# Altium schematic sheet midi_input.SchDoc
size A4; Organization: Altium Limited; Address1: L3, 12a Rodborough Rd; Address2: Frenchs Forest; Address3: NSW; Address4: Australia 2086
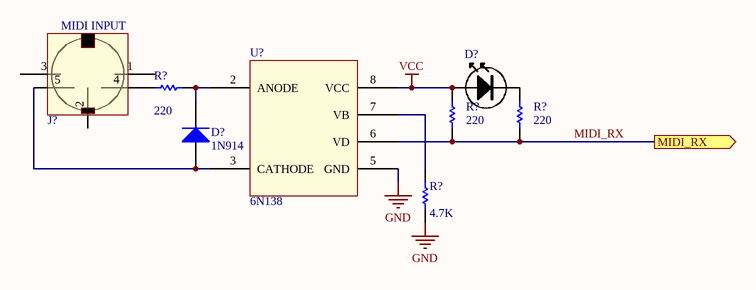
[diagram p0: midi_input.SchDoc]

## Parts
(Parts that share a designator on the sheet are numbered #1, #2 ... from top to bottom, then left to right.)
D?#1  LED-GREEN-5MM  [LED-5MM-GREEN]  (value not drawn)
D?#2  1N914  [DO-35]
J?  MIDI INPUT  [SDS-50J]
R?#1  value 220  [AXIAL-0.3]
R?#2  value 220  [AXIAL-0.3]
R?#3  value 220  [AXIAL-0.3]
R?#4  value 4.7K  [AXIAL-0.3]
U?  6N138  [DIP8]

## Ports
MIDI_RX (out)

## Nets
GND: R?#4.1 U?.5(GND)
VCC: D?#1.A R?#2.2 U?.8(VCC)
MIDI_RX: R?#2.1 R?#3.1 U?.6(VD) ; port MIDI_RX
NetD?#1_K: D?#1.K R?#3.2
NetD?#2_1: D?#2.1(A) J?.5 U?.3(CATHODE)
NetD?#2_2: D?#2.2(K) R?#1.1 U?.2(ANODE)
NetJ?_4: J?.4 R?#1.2
NetR?#4_2: R?#4.2 U?.7(VB)

Not connected (* = marked no-connect by the designer): J? 1 2 3

## Notes on the sheet
- Title
- Size:
- Date:
- A4
- Number:
- Time:
- Revision:
- Sheet
- of
- File:

## Library data of the parts
D?#1 = LED-GREEN-5MM: Manufacturer: Cree Inc; Manufacturer Part Number: C4SMF-GJS-CV0Y0792; Description: LED 4MM OVAL GREEN 527NM; Color: Green; Wavelength - Dominant: 527nm; Millicandela Rating: 5165mcd; Voltage - Forward (Vf) (Typ): 3.4V; Current - Test: 20mA; Lens Transparency: Clear; Lens Style/Size: Oval with Domed Top, 4.20mm x 3.10mm; Supplier 1: Digi-Key; RoHS: RoHS Compliant; Category: Optoelectronics; Stock 1: 5356; Pricing 1: 1=0.22, 10=0.205, 100=0.1892, 1000=0.169 (USD); Packaging: Cut Tape (CT); Wavelength - Peak: -; Viewing Angle: -; Lens Color: Green; Package / Case: Radial; Supplier Device Package: 4mm Oval; Size / Dimension: -; Height (Max): 10.35mm; Mounting Type: Through Hole; ComponentLink1URL: http://www.cree.com/~/media/Files/Cree/LED%20Components%20and%20Modules/HB/Data%20Sheets/C4SMF%20C4SME%20RJS%20GJS%20BJS%20829.pdf; ComponentLink1Description: http://www.cree.com/~/media/Files/Cree/LED%20Components%20and%20Modules/HB/Data%20Sheets/C4SMF%20C4SME%20RJS%20GJS%20BJS%20829.pdf
D?#2 = 1N914: High Conductance Fast Diode; Manufacturer: Fairchild Semiconductor; Manufacturer Part Number: 1N914BTR; Description: DIODE GEN PURP 100V 200MA DO35; Diode Type: Standard; Voltage - DC Reverse (Vr) (Max): 100V; Current - Average Rectified (Io): 200mA; Voltage - Forward (Vf) (Max) @ If: 1V @ 100mA; Speed: Small Signal =< 200mA (Io), Any Speed; Reverse Recovery Time (trr): 4ns; Current - Reverse Leakage @ Vr: 5µA @ 75V; Capacitance @ Vr, F: 4pF @ 0V, 1MHz; Published: 8-Jun-2000; LatestRevisionDate: 17-Jul-2002; LatestRevisionNote: Re-released for DXP Platform.; DatasheetDocument: 1997; PackageReference: DO-35; Publisher: Altium Limited; Code_JEDEC: DO-204-AH; ComponentLink1Description: Manufacturer Link; ComponentLink1URL: http://www.fairchildsemi.com/; ComponentLink2Description: Datasheet; ComponentLink2URL: http://www.fairchildsemi.com/ds/1N%2F1N914.pdf; Supplier 1: Digi-Key; RoHS: RoHS Compliant; Category: Discrete Semiconductor Products; Stock 1: 135448; Pricing 1: 1=0.1, 10=0.064, 25=0.058, 100=0.0417, 250=0.02456, 500=0.02038, 1000=0.01391, 2500=0.01184, 5000=0.01067 (USD); Packaging: Cut Tape (CT); Mounting Type: Through Hole; Package / Case: DO-204AH, DO-35, Axial; Supplier Device Package: DO-35; Operating Temperature - Junction: -65°C ~ 175°C; ComponentLink3URL: http://www.fairchildsemi.com/datasheets/1N/1N914.pdf; ComponentLink3Description: http://www.fairchildsemi.com/datasheets/1N/1N914.pdf
J? = SDS-50J: Right-Angle Female MIDI Connector; Manufacturer: CUI Inc; Connector Type: Receptacle, Female Sockets; Number of Positions: 5; Current Rating: 2A, 1A; Voltage - Rated: 100VAC, 24VDC; Supplier 1: Digi-Key; Manufacturer Part Number: SDS-50J; RoHS: RoHS Compliant; Category: Connectors, Interconnects; Stock 1: 34152; Pricing 1: 1=1.05, 10=0.814, 100=0.621, 500=0.4968, 1000=0.4416, 2500=0.36708 (USD); Packaging: Bulk; Shell Size - Insert: DIN (180 Degree); Shell Size, MIL: -; Mounting Type: Through Hole, Right Angle; Termination: Solder; Fastening Type: Push-Pull; Orientation: Keyed; Ingress Protection: -; Shell Material, Finish: Polybutylene Terephthalate (PBT); Contact Finish: Tin; Features: -; Contact Finish Thickness: -; Operating Temperature: -40°C ~ 85°C; ComponentLink1URL: http://www.cui.com/product/resource/digikeypdf/sds-xxj.pdf; ComponentLink1Description: http://www.cui.com/product/resource/digikeypdf/sds-xxj.pdf
R?#1-R?#3 = Res1: Resistor; Manufacturer: Stackpole Electronics Inc; Manufacturer Part Number: CF14JT220R; Description: RES 220 OHM 1/4W 5% CARBON FILM; Tolerance: ±5%; Power (Watts): 0.25W, 1/4W; Temperature Coefficient: 0/ -400ppm/°C; Published: 8-Jun-2000; LatestRevisionDate: 17-Jul-2002; LatestRevisionNote: Re-released for DXP Platform.; PackageReference: AXIAL-0.3; Publisher: Altium Limited; PackageDescription: Axial Device, Thru-Hole; 2 Leads; 0.3 in Pin Spacing; Supplier 1: Digi-Key; RoHS: RoHS Compliant; Category: Resistors; Stock 1: 116325; Pricing 1: 1=0.1, 10=0.053, 50=0.0288, 100=0.0219, 250=0.01624, 500=0.012, 1000=0.008, 2500=0.00675 (USD); Packaging: Cut Tape (CT); Resistance (Ohms): 220; Composition: Carbon Film; Features: Flame Retardant Coating, Moisture Resistant, Safety; Operating Temperature: -55°C ~ 155°C; Package / Case: Axial; Supplier Device Package: Axial; Size / Dimension: 0.091" Dia x 0.256" L (2.30mm x 6.50mm); Height: -; Number of Terminations: 2; ComponentLink1URL: http://www.seielect.com/catalog/SEI-CF_CFM.pdf; ComponentLink1Description: http://www.seielect.com/catalog/SEI-CF_CFM.pdf
R?#4 = Res1: Resistor; Manufacturer: Stackpole Electronics Inc; Manufacturer Part Number: CF14JT4K70; Description: RES 4.7K OHM 1/4W 5% CARBON FILM; Tolerance: ±5%; Power (Watts): 0.25W, 1/4W; Temperature Coefficient: 0/ -400ppm/°C; Published: 8-Jun-2000; LatestRevisionDate: 17-Jul-2002; LatestRevisionNote: Re-released for DXP Platform.; PackageReference: AXIAL-0.3; Publisher: Altium Limited; PackageDescription: Axial Device, Thru-Hole; 2 Leads; 0.3 in Pin Spacing; Supplier 1: Digi-Key; RoHS: RoHS Compliant; Category: Resistors; Stock 1: 348774; Pricing 1: 1=0.1, 10=0.053, 50=0.0288, 100=0.0219, 250=0.01624, 500=0.012, 1000=0.008, 2500=0.00675 (USD); Packaging: Cut Tape (CT); Resistance (Ohms): 4.7k; Composition: Carbon Film; Features: Flame Retardant Coating, Moisture Resistant, Safety; Operating Temperature: -55°C ~ 155°C; Package / Case: Axial; Supplier Device Package: Axial; Size / Dimension: 0.091" Dia x 0.256" L (2.30mm x 6.50mm); Height: -; Number of Terminations: 2; ComponentLink1URL: http://www.seielect.com/catalog/SEI-CF_CFM.pdf; ComponentLink1Description: http://www.seielect.com/catalog/SEI-CF_CFM.pdf
U? = 6N138: Manufacturer: Lite-On Inc; Number of Channels: 1; Voltage - Isolation: 5000Vrms; Current Transfer Ratio (Min): 300% @ 1.6mA; Current Transfer Ratio (Max): 2600% @ 1.6mA; Turn On / Turn Off Time (Typ): 1.6µs, 10µs; Input Type: DC; Output Type: Darlington with Base; Voltage - Output (Max): 7V; Current - Output / Channel: 50mA; Voltage - Forward (Vf) (Typ): 1.1V; Current - DC Forward (If) (Max): 20mA; Description: OPTOISO 5KV DARL W/BASE 8DIP; Supplier 1: Digi-Key; Manufacturer Part Number: 6N138; RoHS: RoHS Compliant; Category: Isolators; Stock 1: 4131; Pricing 1: 1=0.73, 10=0.567, 100=0.405, 250=0.3564, 500=0.3078, 1000=0.243, 2500=0.2268, 5000=0.2187, 10000=0.216 (USD); Packaging: Tube; Rise / Fall Time (Typ): -; Vce Saturation (Max): -; Operating Temperature: -20°C ~ 85°C; Mounting Type: Through Hole; Package / Case: 8-DIP (0.300", 7.62mm); Supplier Device Package: 8-DIP; ComponentLink1URL: http://optoelectronics.liteon.com/upload/download/DS70-2009-0001/S_110_6N138-L,%206N139-L.pdf; ComponentLink1Description: http://optoelectronics.liteon.com/upload/download/DS70-2009-0001/S_110_6N138-L,%206N139-L.pdf; Supplier 2: Digi-Key; Stock 2: 1576; Pricing 2: 1=1.08, 10=0.84, 25=0.696, 100=0.6, 250=0.528, 500=0.456, 750=0.3984, 1000=0.36, 2500=0.336 (USD); ComponentLink2URL: http://www.isocom.com/images/stories/isocom/isocom_new_pdfs/dc93135.pdf; ComponentLink2Description: http://www.isocom.com/images/stories/isocom/isocom_new_pdfs/dc93135.pdf